# EasyEDA schematic SCH_LatencyMeter_Loc1_2024-01-18.json
TITLE: Sheet_1; REV: 1.0; Date: 2024-01-18; Sheet: 1/1; Drawn By: KimIV; Company: Your Company
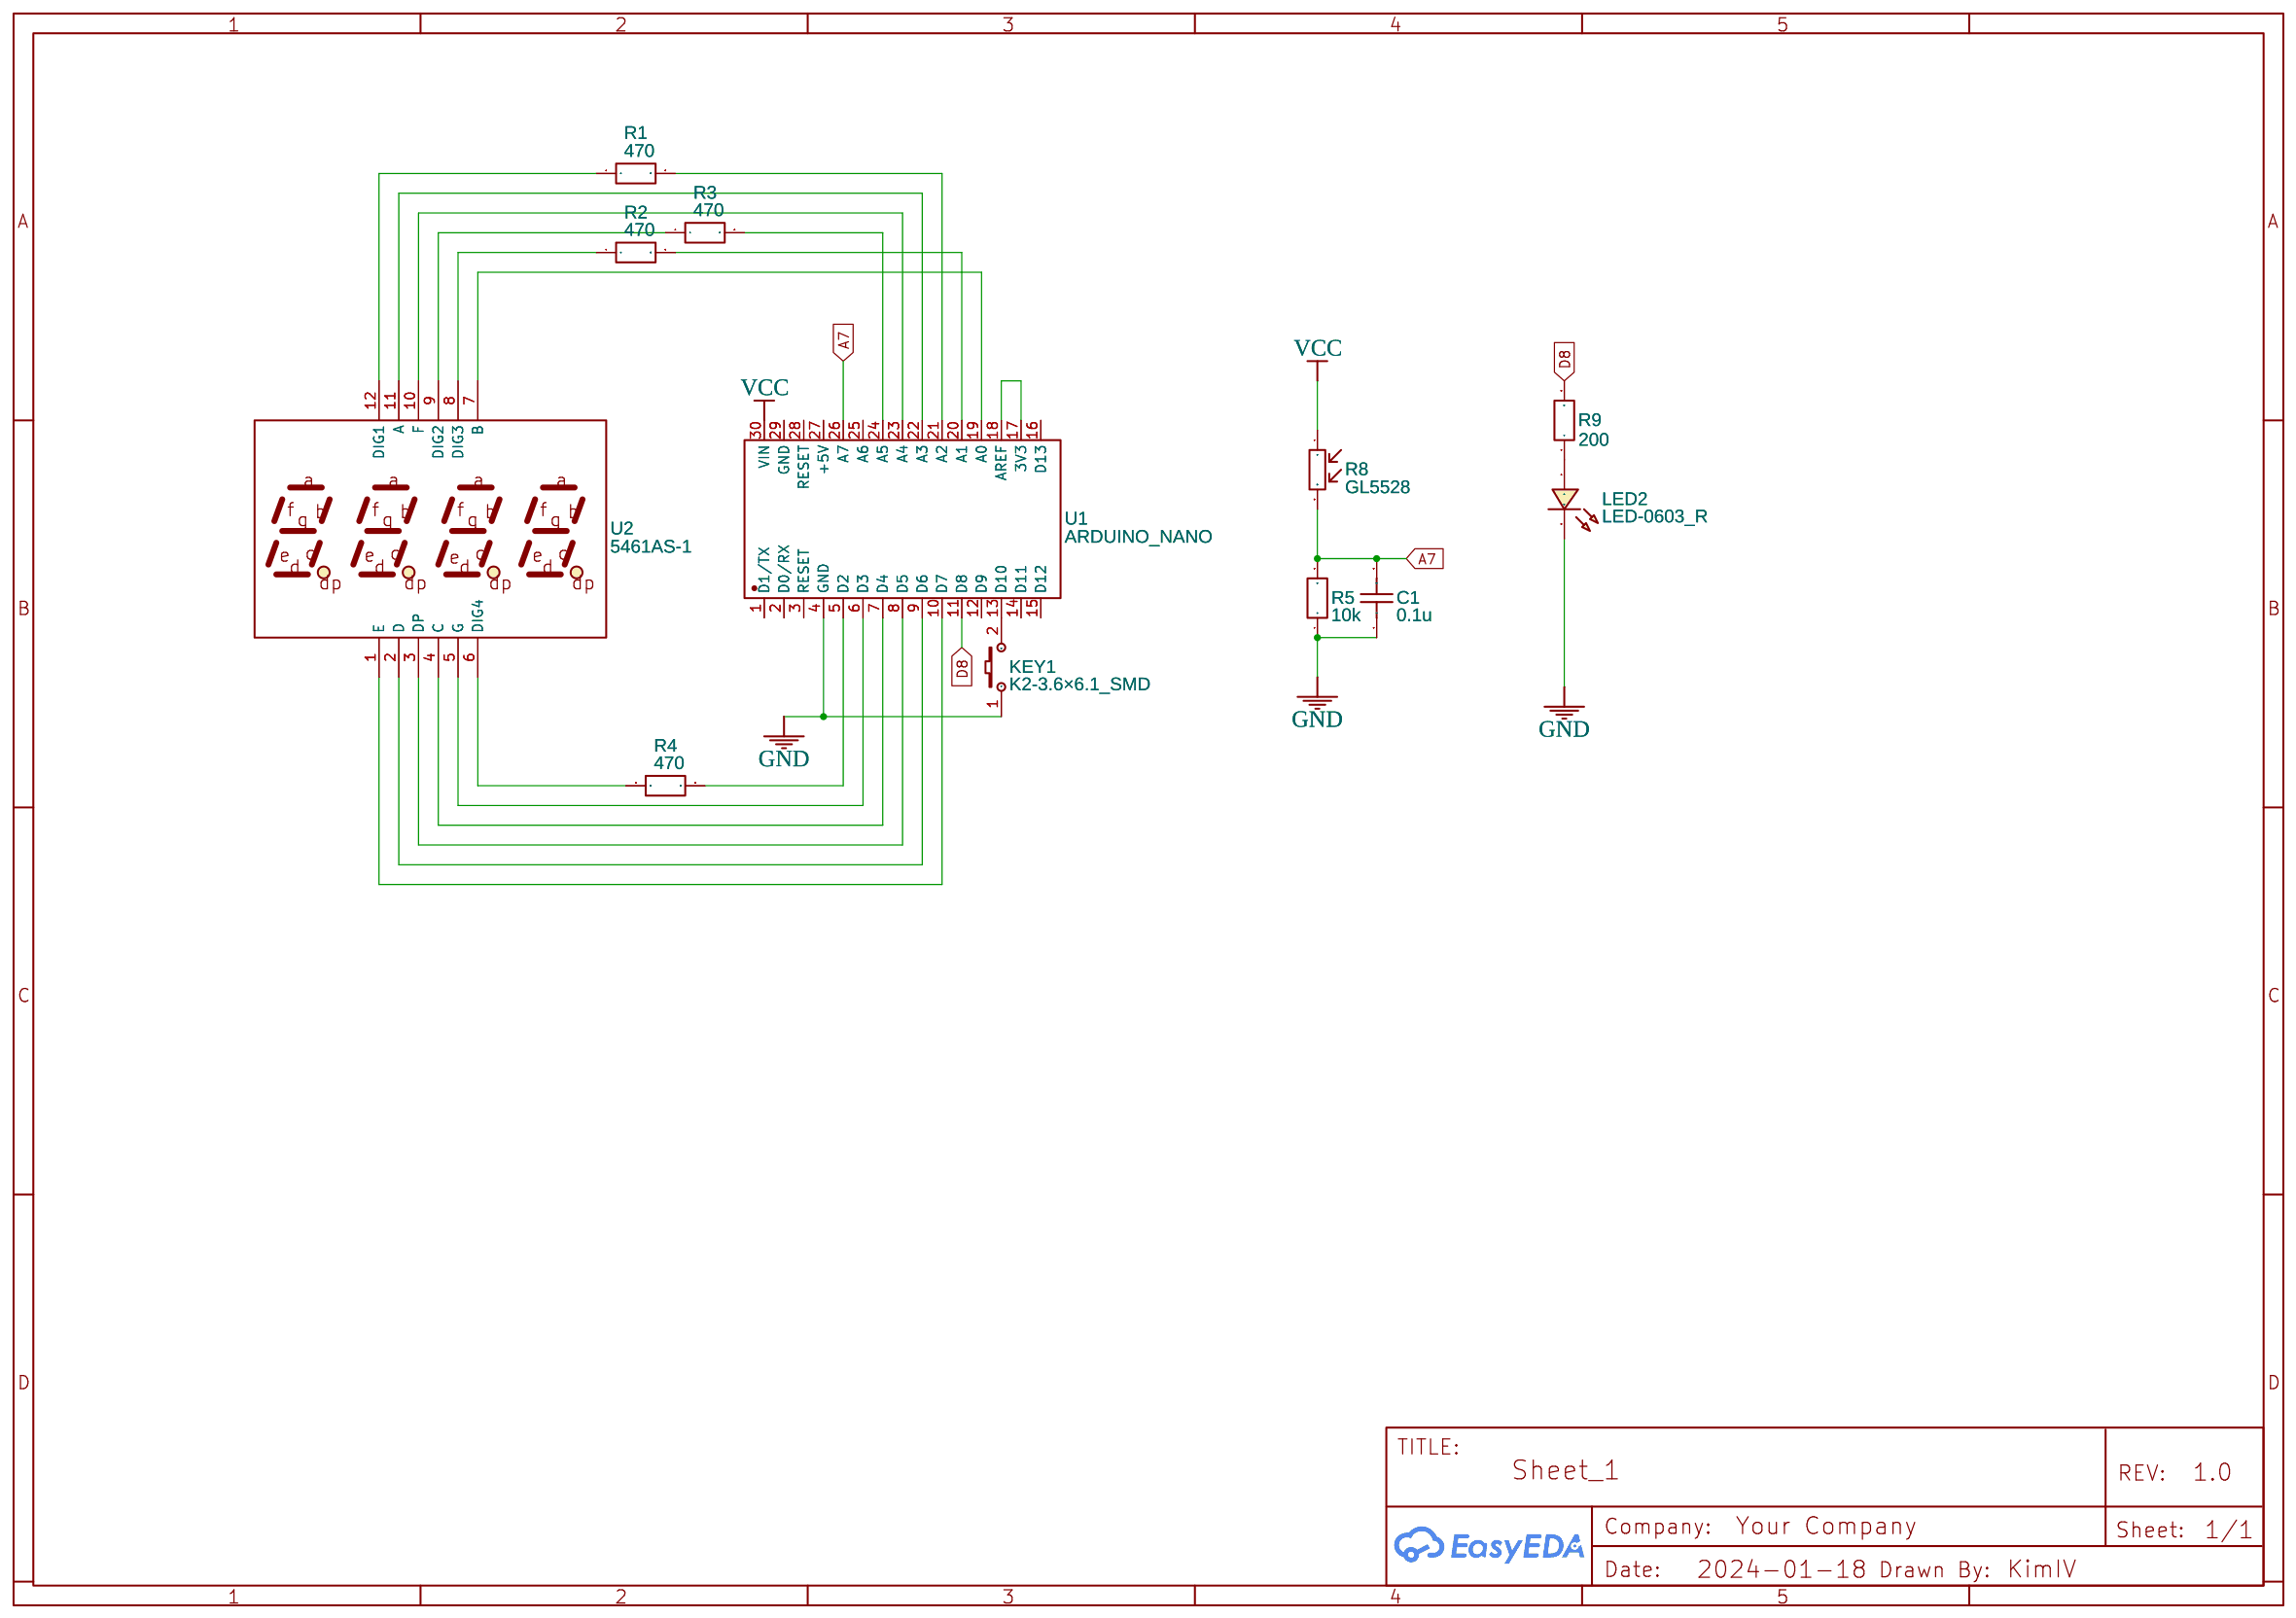
[diagram p0: schematic sheet]

## Parts
C1  0.1u  [C0603]
KEY1  K2-3.6×6.1_SMD  [KEY-SMD_2P-L6.2-W3.6-LS8.0]
LED2  LED-0603_R  [LED0603_RED]
R1  470  [R0603]
R2  470  [R0603]
R3  470  [R0603]
R4  470  [R0603]
R5  10k  [R0603]
R8  GL5528  [RES-TH_L5.1-W4.3-P3.40-D0.5]
R9  200  [R0603]
U1  ARDUINO_NANO  [COMM-TH_ARDUINO_NANO]
U2  5461AS-1  [LED-SEG-TH_12P-L50.4-W19.0-P2.54-S15.24-BL]

## Library data of the parts
C1 = C_0603_US: Contributor: LCEDA_Lib
KEY1 = K2-3.6×6.1_SMD: Supplier Part: C118141; Supplier: LCSC; Manufacturer Part: K2-1107ST-A4SW-06; Contributor: LCEDA_Lib; 制造商: 韩国韩荣
LED2 = LED-0603_R: Manufacturer: EVERLIGHT(台湾亿光); Manufacturer Part: 19-217/R6C-AL1M2VY/3T; Supplier Part: C72044; Supplier: LCSC; Contributor: LCEDA_01
R1-R5 R9 = R_0603_EU: Contributor: LCEDA_Lib
R8 = GL5528: Supplier: LCSC; Manufacturer: 森霸; Supplier Part: C125627; JLCPCB Part Class: Extended Part; link: https://lcsc.com/eda_search?q=C125627&%26type=1&ref=editor
U1 = ARDUINO_NANO: Contributor: lcsc; Supplier: LCSC; Supplier Part: C9900017879; Manufacturer: null; JLCPCB Part Class: Extended Part; link: https://lcsc.com/eda_search?q=C9900017879&%26type=1&ref=editor
U2 = 5461AS-1: Contributor: lcsc; Supplier: LCSC; Supplier Part: C9900039509; Manufacturer: null; link: https://lcsc.com/eda_search?q=C9900039509&%26type=1&ref=editor

## Nets
GND: C1.1 KEY1.1 LED2.2 R5.1 U1.4(GND)
VCC: R8.1 U1.30(VIN)
A7: C1.2 R5.2 R8.2 U1.26(A7)
D8: R9.2 U1.11(D8)
Net-(KEY1-2): KEY1.2 U1.13(D10)
Net-(LED2-1): LED2.1 R9.1
Net-(R1-1): R1.1 U2.12(DIG1)
Net-(R1-2): R1.2 U1.21(A2)
Net-(R2-1): R2.1 U2.8(DIG3)
Net-(R2-2): R2.2 U1.20(A1)
Net-(R3-1): R3.1 U2.9(DIG2)
Net-(R3-2): R3.2 U1.24(A5)
Net-(R4-1): R4.1 U2.6(DIG4)
Net-(R4-2): R4.2 U1.5(D2)
Net-(U1-6): U1.6(D3) U2.5(G)
Net-(U1-7): U1.7(D4) U2.4(C)
Net-(U1-8): U1.8(D5) U2.3(DP)
Net-(U1-9): U1.9(D6) U2.2(D)
Net-(U1-10): U1.10(D7) U2.1(E)
Net-(U1-17): U1.17(3V3) U1.18(AREF)
Net-(U1-19): U1.19(A0) U2.7(B)
Net-(U1-22): U1.22(A3) U2.11(A)
Net-(U1-23): U1.23(A4) U2.10(F)

Not connected (* = marked no-connect by the designer): U1 1(D1/TX) 2(D0/RX) 3(RESET) 12(D9) 14(D11) 15(D12) 16(D13) 25(A6) 27(+5V) 28(RESET) 29(GND)
